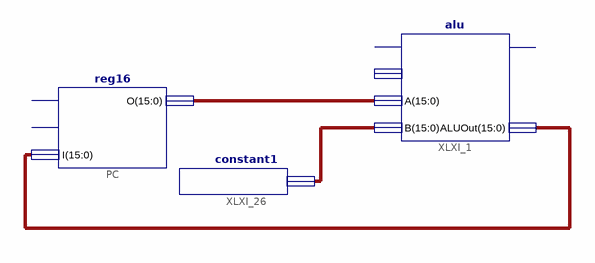
[diagram p0: schematic sheet 1]
// Xilinx ISE schematic pc_add_1.sch (spartan3adsp) as structural Verilog: 3 symbols, 0 ports
module pc_add_1 (
);

  wire [15:0] XLXN_1, XLXN_2, XLXN_3;

  reg16 PC (.I(XLXN_3), .O(XLXN_1));  // open: CLK, Write
  alu XLXI_1 (.A(XLXN_1), .B(XLXN_2), .ALUOut(XLXN_3));  // open: Flip, ALUct1, Zero
  constant1 XLXI_26 (.O(XLXN_2));
endmodule
